# EAGLE design Adafruit VCNL4040 (EAGLE 9.3.2)
COMPANY: ADAFRUIT INDUSTRIES; DRAWN: KATTNI; REV: A
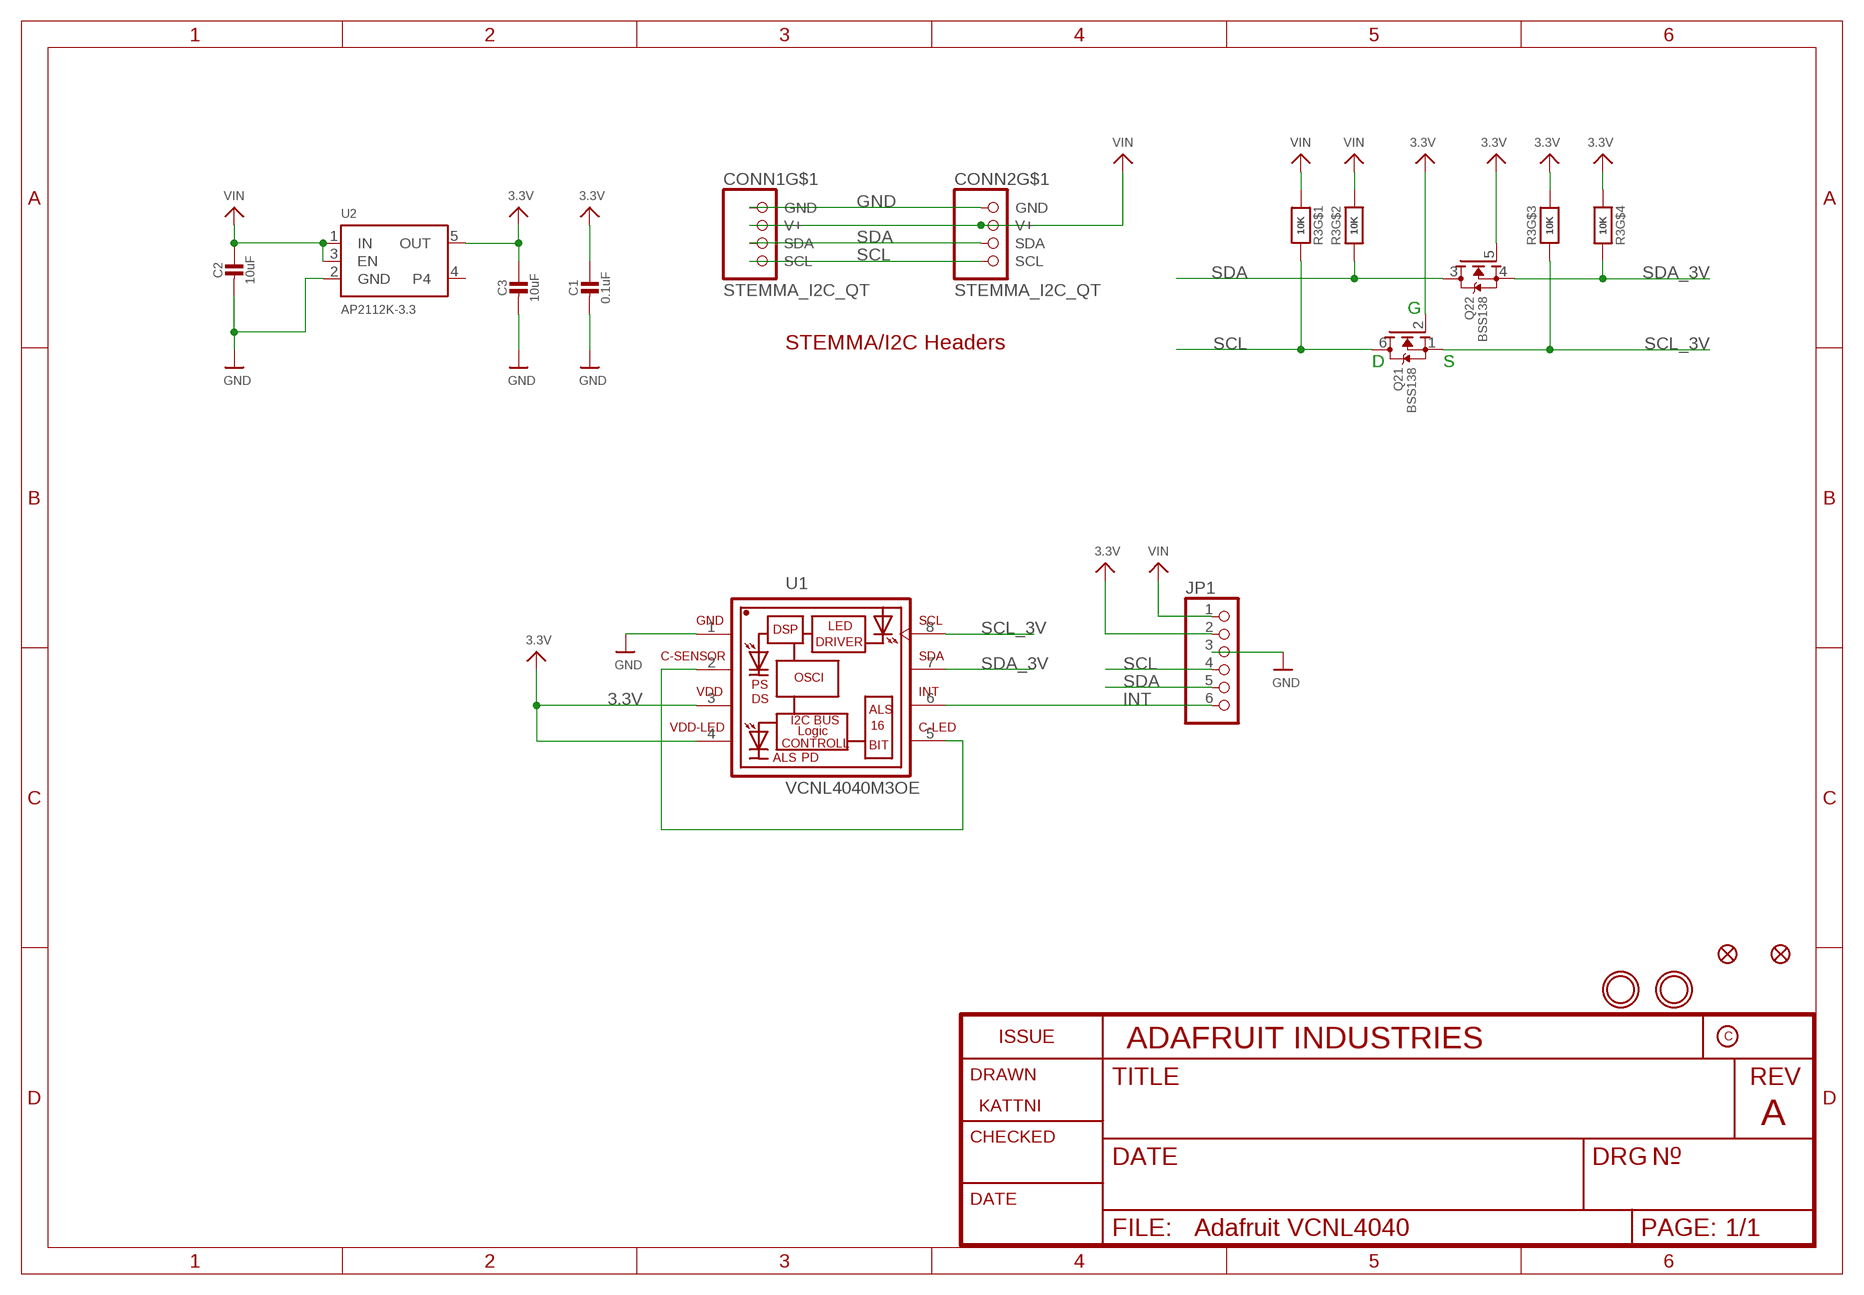
[diagram p0: schematic, sheet 1]

## Parts
C1  0.1uF  CAP_CERAMIC0603_NO  [0603-NO]
C2  10uF  CAP_CERAMIC0805-NOOUTLINE  [0805-NO]
C3  10uF  CAP_CERAMIC0805-NOOUTLINE  [0805-NO]
CONN1  STEMMA_I2C_QT  [JST_SH4]
CONN2  STEMMA_I2C_QT  [JST_SH4]
FID1  FIDUCIAL_1MM  [FIDUCIAL_1MM]
FID2  FIDUCIAL_1MM  [FIDUCIAL_1MM]
JP1  HEADER-1X670MIL  [1X06_ROUND_70]
Q2  BSS138  MOSFET-N_DUAL  [SOT363]
R3  10K  RESISTOR_4PACK  [RESPACK_4X0603]
U1  VCNL4040M3OE  [VISHAY_VCNL4040_4X2X1.1]
U2  AP2112K-3.3  VREG_SOT23-5  [SOT23-5]
U$3  MOUNTINGHOLE2.5  [MOUNTINGHOLE_2.5_PLATED]
U$4  MOUNTINGHOLE2.5  [MOUNTINGHOLE_2.5_PLATED]

## Nets
3.3V: C1.1 C3.1 JP1.2 Q2.2(1:G) Q2.5(2:G) R3.5 R3.6 U1.3(VDD) U1.4(VDD-LED) U2.5(OUT)
CATHODE: U1.2(C-SENSOR) U1.5(C-LED)
GND: C1.2 C2.2 C3.2 CONN1.1(GND) CONN2.1(GND) JP1.3 U1.1(GND) U2.2(GND)
INT: JP1.6 U1.6(INT)
SCL: CONN1.4(SCL) CONN2.4(SCL) JP1.4 Q2.6(1:D) R3.8
SCL_3V: Q2.1(1:S) R3.3 U1.8(SCL)
SDA: CONN1.3(SDA) CONN2.3(SDA) JP1.5 Q2.3(2:D) R3.7
SDA_3V: Q2.4(2:S) R3.4 U1.7(SDA)
VIN: C2.1 CONN1.2(V+) CONN2.2(V+) JP1.1 R3.1 R3.2 U2.1(IN) U2.3(EN)
Unconnected: CONN1.MT1(MT) CONN1.MT2(MT) CONN2.MT1(MT) CONN2.MT2(MT) U2.4

## Notes on the sheet
- G
- STEMMA/I2C Headers
- D | S

## Library data of the parts
C1-C3 = microbuilder:CAP_CERAMIC: Ceramic Capacitors For new designs, use the packages preceded by an '_' character since they are more reliable: The following footprints should be used on most boards: _0402 - Standard footprint for regular board layouts _0603 - Standard footprint for regular board layouts _0805 - Standard footprint for regular board layouts _1206 - Standard footprint for regular board layouts For extremely tight-pitch boards where space is at a premium, the following 'micro-pitch' footprints can be used (smaller pads, no silkscreen outline, etc.): _0402MP - Micro-pitch footprint for very dense/compact boards _0603MP - Micro-pitch footprint for very dense/compact boards _0805MP - Micro-pitch footprint for very dense/compact boards _1206MP - Micro-pitch footprint for very dense/compact boards
CONN1 CONN2 = microbuilder:STEMMA_I2C
FID1 FID2 = microbuilder:FIDUCIAL: Fiducial Alignment Points Various fiducial points for machine vision alignment.; BOM: EXCLUDE
JP1 = microbuilder:HEADER-1X6: PIN HEADER
Q2 = microbuilder:MOSFET-N_DUAL: Dual N-Channel MOSFET SOT363 (2.0x1.25mm) 2N7002PS - 60V, 320mA [Digikey: 568-5984-1-ND]
R3 = microbuilder:RESISTOR_4PACK: Resistor Packs (4 resistors) 4 x 0603 10K 1/16W - Digikey: YC164J-10KCT-ND
U1 = VCNL4040M3OE:VCNL4040M3OE: VCNL4040 Fully Integrated Proximity and Ambient Light Sensor with Infrared Emitter, I2C Interface, and Interrupt Function: VCNL4040 integrates a proximity sensor (PS), ambient light sensor (ALS), and a high power IRED into one small package. It incorporates photodiodes, amplifiers, and analog to digital converting circuits into a single chip by CMOS process. The 16-bit high resolution ALS offers excellent sensing capabilities with sufficient selections to fulfill most applications whether dark or high transparency lens design. High and low interrupt thresholds can be programmed for both ALS and PS, allowing the component to use a minimal amount of the microcontrollers resources. Device Model created 15.06.2016 by Johannes Kolb - Vishay Semiconductor GmbH; AVAILABILITY: Unavailable; DESCRIPTION: VCNL4040 Series 3.6 V 200 mm 16 Bit I2C SMT Proximity and Ambient Light Sensor; MF: Vishay; MP: VCNL4040M3OE; PACKAGE: SMD-8 Vishay; PRICE: None
U2 = microbuilder:VREG_SOT23-5: SOT23-5 Fixed Voltage Regulators Part Current Out V Out V In V Dropout θJA (°C/W) TJ (°C) Digikey Part No. ADP121 150mA 3.3V 3.4-5.5V 0.09V @ 150mA -- -- ADP121-AUJZ33R7CT-ND ADP121 150mA 3.0V 3.1-5.5V 0.09V @ 150mA -- -- ADP121-AUJZ30R7CT-ND ADP122 300mA 3.3V 3.4-5.5V 0.085V @ 300mA -- -- ADP122AUJZ-3.3-R7CT-ND ADP1712 300mA 3.3V 3.5-5.5V 0.17V @ 300mA -- -- ADP1712AUJZ-3.3-R7TR-ND AP7311 (Low Cost) 150mA 3.3V 3.5-6V 0.15V @ 150mA -- -- AP7311-33WG-7DICT-ND LD39015M18R 150mA 1.8V 1.9V-5.5V 0.08V @ 100mA -- -- 497-6977-1-ND LP2985A-33DBVR 150mA 3.3V 3.3-16V 0.28V @ 150mA 206 150 296-18479-1-ND MCP1824T-3302E/OT 300mA 3.3V 3.5V-6V 0.2V @ 300mA -- -- MCP1824T-3302E/OTCT-ND MIC5205-2.5YM5 TR 150mA 2.5V 2.7-16V 0.165V @ 150mA -- -- 576-1257-2-ND MIC5205-3.0YM5 TR 150mA 3.0V 3.2V-16V 0.165V @ 150mA -- -- 576-1258-2-ND MIC5205-3.3YM5 TR 150mA 3.3V 3.5V-16V 0.165V @ 150mA -- -- 576-1259-2-ND TPS780330220 150mA 3.3V+2.2V 3.6-5.5V 250mV Max -- -- 296-23332-1-ND TDA3663/N1,135 100mA 3.3V 3.5-45V 0.18V @ 50mA -- -- 568-5343-1-ND Max operating temp can be calculated using θJA, TJ (max junction temperature), and power in watts. Set the "Maximum Ambient Temperature" until it reaches TJ ("Max Junction Temperature"), which is the absolute limit for safe use of the regulator: Heat Sink Temperature Calculator <http://www.daycounter.com/Calculators/Heat-Sink-Temperature-Calculator.phtml> For example, With 12V source into a 3.3V LP2985 and a 30mA load, we are dissipating (12V-3.3V) * 0.03A = 0.261W. With a θJA of 206 °C/W, a TJ of 150°C, and 261mW we can safely use the chip without a heat sink up to 75°C (=147.1°C Junction Temperature).
U$3 U$4 = microbuilder:MOUNTINGHOLE: Mounting Hole For #2 screws (0.086"/2.18mm width, 0.094"/2.4mm hole) use 2.5mm; BOM: EXCLUDE

## Board
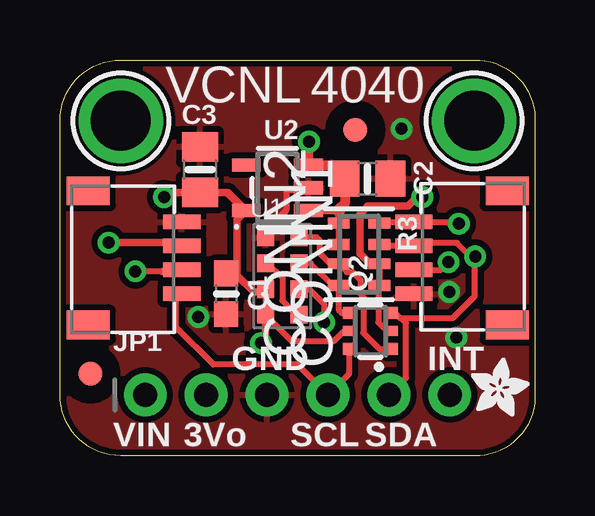
[diagram p1: board, top side]
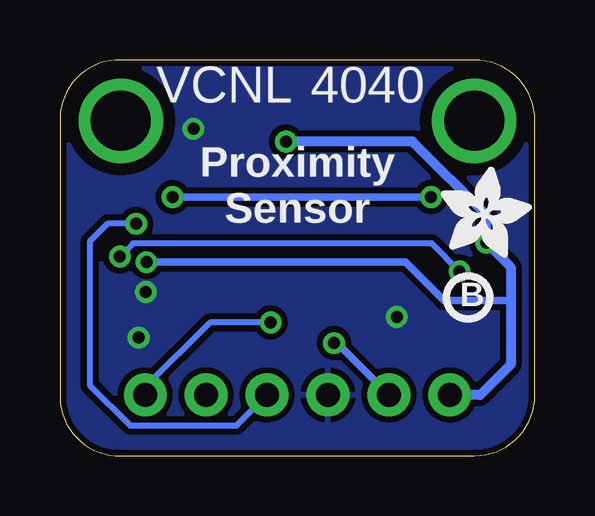
[diagram p2: board, bottom side, seen from below]

Size 19.81 x 16.51 mm. Coordinates in mm from the lower left corner, seen from the top.
Outline: 19.81,14.1 19.81,2.41 arc-90 17.27,0 2.54,0 arc-90 0,2.54 0,13.97 arc-90 2.54,16.51 17.27,16.51 arc-90 19.81,14.1
Copper layers (1*16): Top 0.035mm / dielectric 1.5mm / Bottom 0.035mm
Design rules "adafruit *": minimum track width 8mil, minimum drill 15.5mil, track to track 8mil, track to pad 8mil, pad to pad 8mil, via to via 8mil, smd to smd 8mil, copper to edge 10mil, drill to drill 8mil, minimum pad ring 10mil, minimum via ring 8mil, stop-mask expansion 2mil, vias tented up to drill 20mil, thermal gap 10mil

### Footprints (pad centres in the part's own frame; a part is rotated, then mirrored left to right if it is on the bottom)
0603-NO = smd 1.075 x 1: 1 -0.85,0; 2 0.85,0
0805-NO = smd 1.24 x 1.5: 1 -0.95,0; 2 0.95,0
JST_SH4 = smd 0.6 x 1.55: 1 -1.5,2.514; 2 -0.5,2.514; 3 0.5,2.514; 4 1.5,2.514 | smd 1.2 x 1.8: MT1 -2.8,-1.386; MT2 2.8,-1.386
FIDUCIAL_1MM = smd 1 x 1: 1 0,0
1X06_ROUND_70 = drill 1 pad 1.778: 1 -6.35,0; 2 -3.81,0; 3 -1.27,0; 4 1.27,0; 5 3.81,0; 6 6.35,0
SOT363 = smd 0.5 x 0.5: 1 -0.75,-0.9; 3 0.75,-0.9; 4 0.75,0.9; 6 -0.75,0.9 | smd 0.4 x 0.5: 2 0,-0.9; 5 0,0.9
RESPACK_4X0603 = smd 0.45 x 0.9: 1 -1.3,-0.85; 2 -0.4,-0.85; 3 0.4,-0.85; 4 1.3,-0.85; 5 1.3,0.85; 6 0.4,0.85; 7 -0.4,0.85; 8 -1.3,0.85
VISHAY_VCNL4040_4X2X1.1 = smd 0.7 x 0.725: 1 -0.7,1.613; 2 -0.7,0.537; 3 -0.7,-0.537; 4 -0.7,-1.613; 5 0.7,-1.613; 6 0.7,-0.537; 7 0.7,0.537; 8 0.7,1.613
SOT23-5 = smd 0.55 x 1.2: 1 -0.95,-1.3; 2 0,-1.3; 3 0.95,-1.3; 4 0.95,1.3; 5 -0.95,1.3
MOUNTINGHOLE_2.5_PLATED = drill 2.5 pad 3.2: P$1 0,0

### Placement (x,y rotation side)
C1  6.93,6.76 270 top
C2  12.83,11.56 0 top
C3  5.84,11.94 90 top
CONN1  17.27,8.26 90 top
CONN2  2.57,8.26 270 top
FID1  12.32,13.59 0 top
FID2  1.27,3.43 0 top
JP1  9.91,2.54 0 top
Q2  12.95,5.21 90 top
R3  12.47,8.41 270 top
U1  9.27,7.49 0 top
U2  9.07,11.18 90 top
U$1  [ADAFRUIT_3.5MM]  3.94,8.26 0 bottom
U$3  2.54,13.97 0 top
U$4  17.27,13.97 0 top
U$8  [ADAFRUIT_2.5MM]  17.14,1.65 0 top
U$27  [PCBFEAT-REV-040]  2.79,6.6 0 bottom

### Tracks (layer width: path | path; a pad name or v marks a point on that pad's centre or on a via)
3.3V  (via drill 0.5)
  Top 0.254: R3.6 R3.5 13.27,7.06 13.27,5.57 13.64,5.21 Q2.2 | U2.5 7.72,10.18 6.92,10.99 C3.1 | Q2.5 12.01,5.16 11.79,5.16 11.41,4.78 9.67,4.78 U1.4 U1.3 8.45,6.83 | 7.31,7.61 C1.1
  Top 0.305: 7.39,7.53 7.39,9.85 U2.5 7.01,10.99 4.53,10.99 v4.34,10.79 | 7.39,7.53 8.08,6.83 8.45,6.83 | 7.39,7.53 7.31,7.61 | v8.38,4.7 8.57,4.89 U1.4 | v15.11,10.79 14.86,10.79 14.75,10.69 14.75,10.66 14.51,10.41 12.83,10.41 12.83,10.39 12.52,10.08 12.52,8.44 12.94,8.01 R3.6
  Bottom 0.305: JP1.2 8.26,4.7 v8.38,4.7 | v15.11,10.79 v4.34,10.79
CATHODE
  Top 0.254: U1.2 8.68,8.03 9.27,7.43 9.27,6.48 9.87,5.88 U1.5
GND  (via drill 0.5)
  Top 0.254: U1.1 8.57,9.38 9.44,10.25 9.44,11.09 10.28,11.09 U2.2
  other vias: 16.23,6.83 14.25,13.64 5.77,5.79 16.54,4.93
  pour Top (isolate 0.254): 0,0 0,16.51 19.81,16.51 19.81,0
  pour Bottom (isolate 0.254): 0,0 0,16.51 19.81,16.51 19.81,0
INT  (via drill 0.5)
  Top 0.254: U1.6 10.39,6.96 11.02,6.32 v11.02,5.56
  Bottom 0.254: v11.02,5.56 13.56,5.56 16.26,2.87 JP1.6
SCL  (via drill 0.5)
  Top 0.254: R3.8 13.37,9.76 CONN1.4 16.56,9.76 v16.64,9.68 | Q2.6 12.05,3.42 JP1.4 9.91,3.81 6.4,3.81 4.85,5.36 4.85,6.53 CONN2.4
  Bottom 0.254: v16.64,9.68 17.82,9.68 18.56,8.94 18.56,2.94 16.89,1.27 12.45,1.27 JP1.4
SCL_3V
  Top 0.254: Q2.1 13.32,4.46 12.65,5.13 12.65,6.64 12.54,6.75 12.54,7.33 12.21,7.66 11.97,7.66 R3.3 11.28,8.01 10.84,8.45 10.84,8.97 10.71,9.11 U1.8
SDA  (via drill 0.5)
  Top 0.254: Q2.3 13.97,5.96 14.19,5.74 14.24,5.74 | 14.24,5.74 14.43,5.54 14.43,3.26 JP1.5 | 17.29,8.15 17.29,6.66 16.37,5.74 14.24,5.74 | 17.29,8.15 16.56,8.88 14.88,8.88 CONN1.3 13.37,8.76 R3.7 | 4.27,7.7 v3.15,7.7 | v17.32,8.31 17.29,8.29 17.29,8.15
  Top 0.305: CONN2.3 5.02,7.7 4.27,7.7
  Bottom 0.254: v3.15,7.7 4.31,8.86 16.77,8.86 v17.32,8.31
SDA_3V
  Top 0.254: Q2.4 11.76,5.96 11.62,6.09 R3.4 11.38,7.11 10.46,8.03 U1.7
VIN  (via drill 0.5)
  Top 0.254: R3.2 R3.1 11.62,10.16 11.69,10.23 | CONN1.2 15.88,7.75 v16.2,8.08
  Top 0.305: U2.1 11.69,10.23 | CONN2.2 4.94,8.89 v2.03,8.89
  Top 0.406: v10.39,13.11 10.37,13.09 U2.3 11.31,12.13 C2.1 11.88,10.54 11.56,10.23 11.69,10.23 | 10.55,10.23 U2.1
  Bottom 0.305: v16.2,8.08 5.41,8.08 3.81,6.48 1.02,6.48
  Bottom 0.406: v10.39,13.11 5.11,13.11 2.03,10.03 v2.03,8.89 1.02,7.87 1.02,6.48 1.02,3.81 2.29,2.54 JP1.1

### Text on the board
tPlace: VCNL | 4040 | GND | INT | VIN | 3Vo | SCL | SDA
bPlace: 4040 | VCNL | Proximity / Sensor
bStop: by Kattni!